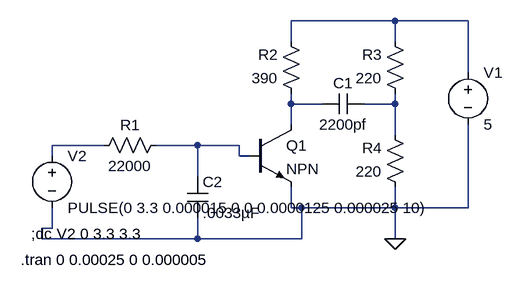
[diagram p0: schematic sonic-amp.asc]
sonic-amp.asc, the LTspice schematic file:
Version 4
SHEET 1 880 680
WIRE 384 16 224 16
WIRE 496 16 384 16
WIRE 224 48 224 16
WIRE 384 48 384 16
WIRE 496 96 496 16
WIRE 224 144 224 128
WIRE 272 144 224 144
WIRE 384 144 384 128
WIRE 384 144 336 144
WIRE 224 176 224 144
WIRE 384 192 384 144
WIRE -64 208 -144 208
WIRE 80 208 16 208
WIRE 144 208 80 208
WIRE -144 224 -144 208
WIRE 144 224 144 208
WIRE 160 224 144 224
WIRE 80 256 80 208
WIRE 224 304 224 272
WIRE 240 304 224 304
WIRE 384 304 384 272
WIRE 384 304 240 304
WIRE 496 304 496 176
WIRE 496 304 384 304
WIRE -144 336 -144 304
WIRE -144 336 -160 336
WIRE -160 352 -160 336
WIRE 80 352 80 320
WIRE 80 352 -160 352
WIRE 240 352 240 304
WIRE 240 352 80 352
WIRE 384 352 384 304
FLAG 384 352 0
SYMBOL npn 160 176 R0
SYMATTR InstName Q1
SYMBOL res 32 192 R90
WINDOW 0 0 56 VBottom 2
WINDOW 3 32 56 VTop 2
SYMATTR InstName R1
SYMATTR Value 22000
SYMBOL res 240 144 R180
WINDOW 0 36 76 Left 2
WINDOW 3 36 40 Left 2
SYMATTR InstName R2
SYMATTR Value 390
SYMBOL res 400 144 R180
WINDOW 0 36 76 Left 2
WINDOW 3 36 40 Left 2
SYMATTR InstName R3
SYMATTR Value 220
SYMBOL res 400 288 R180
WINDOW 0 36 76 Left 2
WINDOW 3 36 40 Left 2
SYMATTR InstName R4
SYMATTR Value 220
SYMBOL cap 336 128 R90
WINDOW 0 0 32 VBottom 2
WINDOW 3 32 32 VTop 2
SYMATTR InstName C1
SYMATTR Value 2200pf
SYMBOL voltage 496 80 R0
WINDOW 123 0 0 Left 2
WINDOW 39 0 0 Left 2
SYMATTR InstName V1
SYMATTR Value 5
SYMBOL voltage -144 208 R0
WINDOW 123 0 0 Left 2
WINDOW 39 0 0 Left 2
SYMATTR InstName V2
SYMATTR Value PULSE(0 3.3 0.000015 0 0 0.0000125 0.000025 10)
SYMBOL cap 64 256 R0
SYMATTR InstName C2
SYMATTR Value .0033µF
TEXT -176 344 Left 2 !;dc V2 0 3.3 3.3
TEXT -192 384 Left 2 !.tran 0 0.00025 0 0.000005

The netlist it stands for:
* sonic-amp.asc
Q1 N002 N005 0 0 NPN
R1 N005 N004 22000
R2 N002 N001 390
R3 N003 N001 220
R4 0 N003 220
C1 N003 N002 2200pf
V1 N001 0 5
V2 N004 0 PULSE(0 3.3 0.000015 0 0 0.0000125 0.000025 10)
C2 N005 0 .0033µF
.model NPN NPN
.model PNP PNP
.lib standard.bjt
;dc V2 0 3.3 3.3
.tran 0 0.00025 0 0.000005
.backanno
.end